# Altium schematic sheet adc.SchDoc
size A4
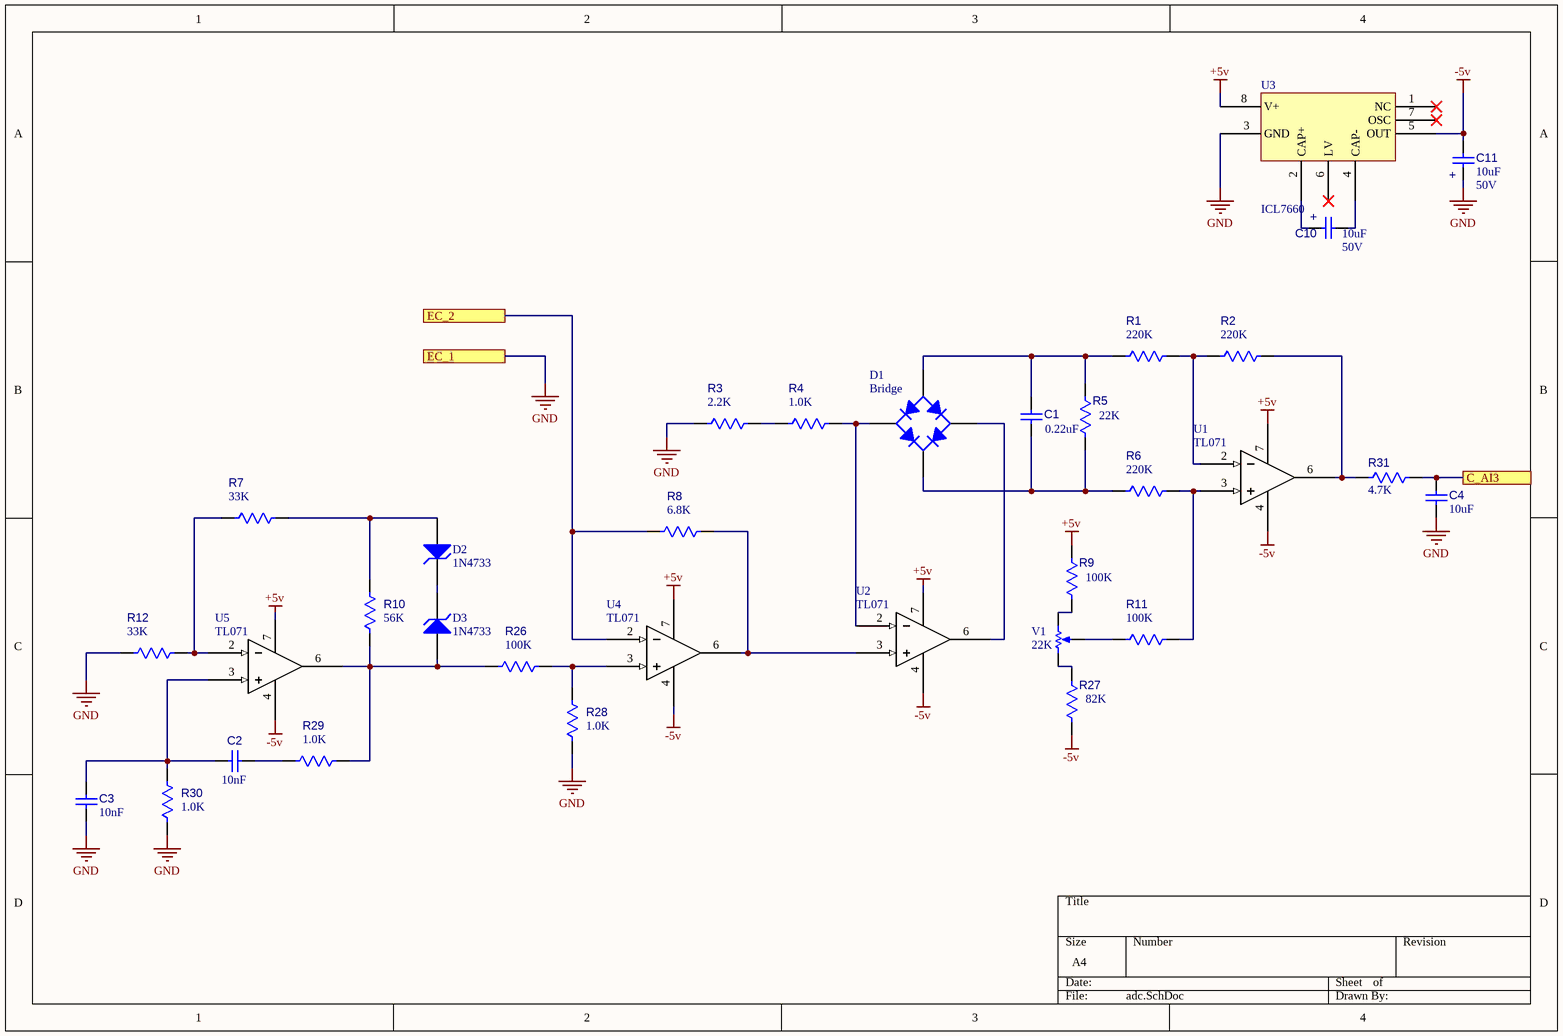
[diagram p0: adc.SchDoc]

## Parts
C1  0.22uF  [RAD-0.1]
C2  10nF  [0805]
C3  value 10nF  [0805]  (hidden comment: Cap)
C4  value 10uF  [CAPC1608x85N]  (hidden comment: Cap)
C10  Voltage-Rated: 50V  [CAPC3216x130N]  (hidden comment: 10uF)
C11  Voltage-Rated: 50V  [CAPC3216x130N]  (hidden comment: 10uF)
D1  Bridge  [BRIDGE_W]
D2  1N4733  [DO-35A]
D3  1N4733  [DO-35A]
R1  220K  [AXIAL-0.3]
R2  220K  [AXIAL-0.3]
R3  2.2K  [0805]
R4  1.0K  [0805]
R5  22K  [0805]
R6  220K  [AXIAL-0.3]
R7  33K  [0805]
R8  6.8K  [AXIAL-0.3]
R9  100K  [0805]
R10  56K  [0603]
R11  100K  [0805]
R12  33K  [0805]
R26  100K  [0805]
R27  82K  [0603]
R28  1.0K  [0805]
R29  1.0K  [0805]
R30  1.0K  [0805]
R31  4.7K  [0805]
U1  TL071  [DIP-8]
U2  TL071  [DIP-8]
U3  ICL7660  [SO8_N]
U4  TL071  [DIP-8]
U5  TL071  [DIP-8]
V1  22K  [TB-3x200]

## Ports
C_AI3, EC_1, EC_2

## Nets
+5v: R9.2 U1.7(+Vcc) U2.7(+Vcc) U3.8(V+) U4.7(+Vcc) U5.7(+Vcc)
-5v: C11.2 R27.1 U1.4(-Vcc) U2.4(-Vcc) U3.5(OUT) U4.4(-Vcc) U5.4(-Vcc)
GND: C3.2 C4.2 C11.1 R3.1 R12.1 R28.2 R30.2 U3.3(GND) ; port EC_1
C_AI3: C4.1 R31.1 ; port C_AI3
EC_2: R8.1 U4.2(-) ; port EC_2
NetC1_1: C1.1 D1.3(A) R1.1 R5.2
NetC1_2: C1.2 D1.1(K) R5.1 R6.1
NetC2_1: C2.1 C3.1 R30.1 U5.3(+)
NetC2_2: C2.2 R29.1
NetC10_1: C10.1 U3.2(CAP+)
NetC10_2: C10.2 U3.4(CAP-)
NetD1_2: D1.2(C) R4.2 U2.2(-)
NetD1_4: D1.4(C) U2.6(output)
NetD2_1: D2.1(A) R7.2 R10.1
NetD2_2: D2.2(K) D3.2(K)
NetD3_1: D3.1(A) R10.2 R26.1 R29.2 U5.6(output)
NetR1_2: R1.2 R2.1 U1.2(-)
NetR2_2: R2.2 R31.2 U1.6(output)
NetR3_2: R3.2 R4.1
NetR6_2: R6.2 R11.2 U1.3(+)
NetR7_1: R7.1 R12.2 U5.2(-)
NetR8_2: R8.2 U2.3(+) U4.6(output)
NetR9_1: R9.1 V1.3(BOT)
NetR11_1: R11.1 V1.2(TAP)
NetR26_2: R26.2 R28.1 U4.3(+)
NetR27_2: R27.2 V1.1(TOP)

Not connected (* = marked no-connect by the designer): U3 1(NC)* 6(LV)* 7(OSC)*

## Notes on the sheet
- (in symbol Cap Pol) +

## Library data of the parts
C1-C4 = Cap: Tolerance: ±10%; Voltage-Rated: 50V
  C1: Package: 0603; Value: 0.22uF
  C2: Package: 0805; Value: 10nF
  C3: Package: 0805
  C4: Package: 0603
C10 C11 = Cap Pol: Cap; Manufacturer: Panasonic; MfgPartNum: EEE-FC1H220P; Tolerance: ±10%; 3rdMfgr: Vishay / MAL214097103E3; Current: 90 mARMS; Package: 8mm dia.; Value: 10uF
D1 = Bridge: Full Wave Diode Bridge; Published: 8-Jun-2000; LatestRevisionDate: 29-May-2009; LatestRevisionNote: Sch pins A & K swapped.; DatasheetVersion: E2732B; PackageReference: D-38; Publisher: Altium Limited; PackageDescription: Bridge Rectifier; 4 Terminals; Body 9.4 x 9.4 mm (typ); Pitch 5.08 mm
D2 D3 = D Zener: Zener Diode 3.3v; Published: 8-Jun-2000; LatestRevisionDate: 17-Jul-2002; LatestRevisionNote: Re-released for DXP Platform.; PackageReference: DIODE-0.7; Publisher: Altium Limited; PackageDescription: Diode, Thru-Hole; 2 Leads; 0.7 in Pin Spacing
R1-R12 R26-R31 = Res: Resistor; Tolerance: 1%; Package: 0603
  R1 R2 R6: Value: 220K
  R3: Value: 2.2K
  R4 R28-R30: Value: 1.0K
  R5: Value: 22K
  R7 R12: Value: 33K
  R8: Value: 6.8K
  R9 R11 R26: Value: 100K
  R10: Value: 56K
  R27: Value: 82K
  R31: Value: 4.7K
U1 U2 U4 U5 = TL071: Low-noise jfet-input operational amplifiers
U3 = ICL7660: CMOS Voltage Converters, from positive to negative for an input range of +1.5V to +10.0V
V1 = Preset: Potentiometer; Sim Note: Enter the Resistance value and the set point into parameter fields.; Set Position: 0.5; Published: 8-Jun-2000; LatestRevisionDate: 17-Jul-2002; LatestRevisionNote: Re-released for DXP Platform.; PackageReference: VR5; Publisher: Altium Limited; PackageDescription: Variable Resistor, Thru-Hole; 3 Leads; Value: 22K